# EAGLE design modularduino_uber (EAGLE 5.04)
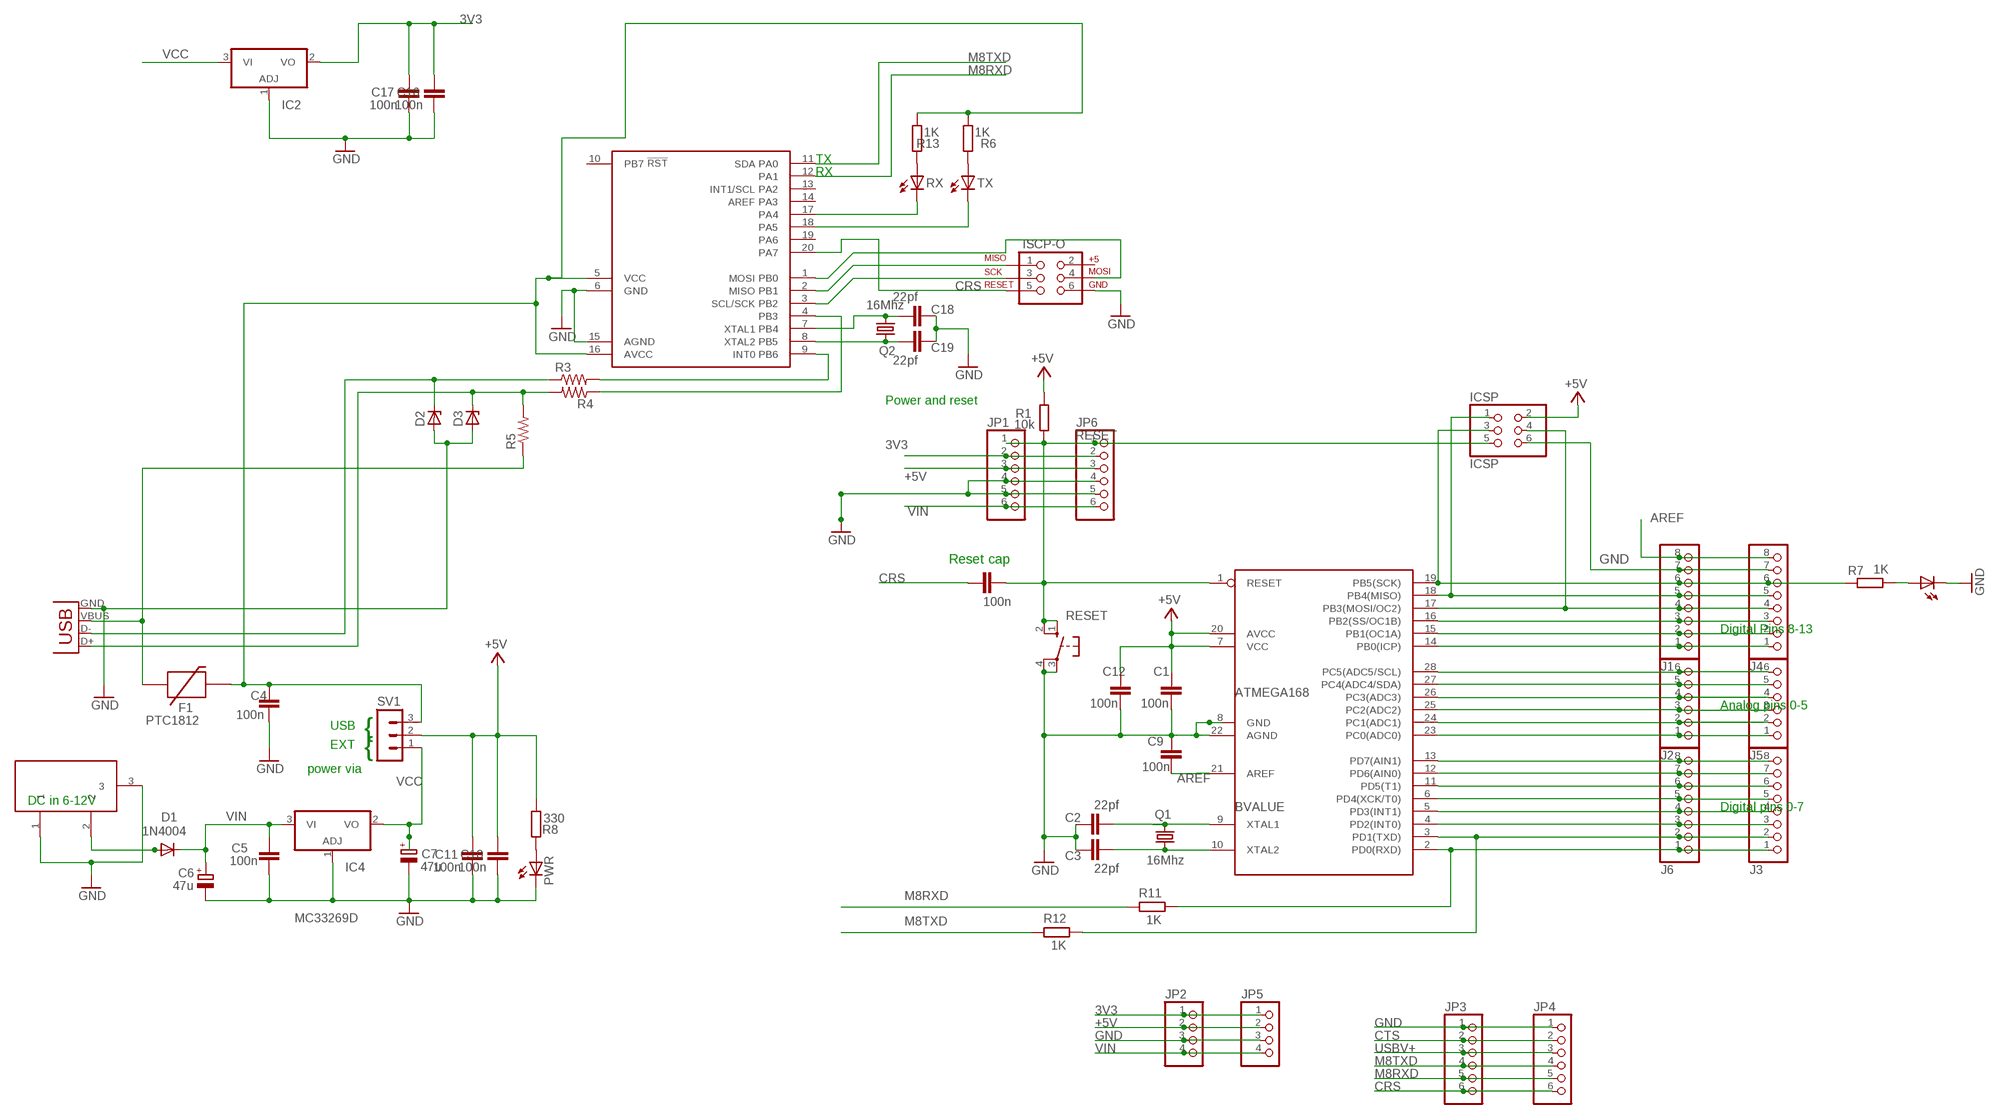
[diagram p0: schematic, sheet 1]

## Parts
BVALUE  ATMEGA168  MEGA8-P  [DIL28-3]
C1  100n  C-EUC1206  [C1206]
C2  22pf  C-EUC1206  [C1206]
C3  22pf  C-EUC1206  [C1206]
C4  100n  C-EUC1206  [C1206]
C5  100n  C-EUC1206  [C1206]
C6  47u  CPOL-EUD  [PANASONIC_D]
C7  47u  CPOL-EUD  [PANASONIC_D]
C9  100n  C-EUC1206  [C1206]
C10  100n  C-EUC1206  [C1206]
C11  100n  C-EUC1206  [C1206]
C12  100n  C-EUC1206  [C1206]
C16  100n  C-EUC1206  [C1206]
C17  100n  C-EUC1206  [C1206]
C18  22pf  C-EUC1206  [C1206]
C19  22pf  C-EUC1206  [C1206]
C20  100n  C-EUC1206  [C1206]
D1  1N4004  DIODEPTH  [DIODE-1N4001]
D2  ZENER-DIODESOD80C  [SOD80C]
D3  ZENER-DIODESOD80C  [SOD80C]
DC1  9V in  DC21MMX  [DC-21MM]
F1  PTC1812  [C1812]
IC2  MC33269D  [DPACK]
IC4  MC33269D  [DPACK]
ICSP  ICSP  PINHD-2X3  [2X03]
ISCP-O  AVR_SPI_PRG_6PTH  [2X3]
J1  PINHD-1X8  [1X08]
J2  PINHD-1X6  [1X06]
J3  PINHD-1X8  [1X08]
J4  PINHD-1X8  [1X08]
J5  PINHD-1X6  [1X06]
J6  PINHD-1X8  [1X08]
JP1  PINHD-1X6  [1X06]
JP2  PINHD-1X4  [1X04]
JP3  PINHD-1X6  [1X06]
JP4  PINHD-1X6  [1X06]
JP5  PINHD-1X4  [1X04]
JP6  PINHD-1X6  [1X06]
P13  LED-LCC1206  [LCC1206]
PWR  LED-LCC1206  [LCC1206]
Q1  16Mhz  CRYSTALHC49U-V  [HC49U-V]
Q2  16Mhz  CRYSTALHC49U-V  [HC49U-V]
R1  10k  R-EU_R1206  [R1206]
R3  R-US_R1206  [R1206]
R4  R-US_R1206  [R1206]
R5  R-US_R1206  [R1206]
R6  1K  R-EU_R1206  [R1206]
R7  1K  R-EU_R1206  [R1206]
R8  330  R-EU_R1206  [R1206]
R11  1K  R-EU_R1206  [R1206]
R12  1K  R-EU_R1206  [R1206]
R13  1K  R-EU_R1206  [R1206]
RESET  10-XX  [B3F-10XX]
RX  LED-LCC1206  [LCC1206]
SV1  MA03-1  [MA03-1]
TX  LED-LCC1206  [LCC1206]
U$1  ATTINY61-PDIP  [DIL20]
X2  USBSMD  [USB-MINIB]

## Nets
3V3 [power]: C16.2 C17.2 IC2.2(VO) JP1.2 JP2.1 JP5.1 JP6.2
+5V [power]: BVALUE.7(VCC) BVALUE.20(AVCC) C1.1 C10.2 C11.2 C12.1 ICSP.2 JP1.3 JP2.2 JP5.2 JP6.3 R1.2 R8.1 SV1.2
AREF: BVALUE.21(AREF) C9.1 J1.8 J4.8
CRS [finepitch]: C20.1 ISCP-O.5 JP3.6 JP4.6 U$1.20(PA7)
CTS: JP3.2 JP4.2
GND [power]: BVALUE.8(GND) BVALUE.22(AGND) C1.2 C2.1 C3.1 C4.1 C5.1 C6.- C7.- C9.2 C10.1 C11.1 C12.2 C16.1 C17.1 C18.1 C19.1 D2.A D3.A DC1.1 DC1.3 IC2.1(ADJ) IC4.1(ADJ) ICSP.6 ISCP-O.6 J1.7 J4.7 JP1.4 JP1.5 JP2.3 JP3.1 JP4.1 JP5.3 JP6.4 JP6.5 P13.C PWR.C RESET.3(P) RESET.4(P1) U$1.6(GND) U$1.15(AGND) X2.GND
M8RXD [finepitch]: JP3.5 JP4.5 R11.1 U$1.12(PA1)
M8TXD [finepitch]: JP3.4 JP4.4 R12.1 U$1.11(PA0)
N$2: BVALUE.15(PB1(OC1A)) J1.2 J4.2
N$3: PWR.A R8.2
N$6: BVALUE.9(XTAL1) C2.2 Q1.2
N$7 [power]: F1.1 R5.1 X2.VBUS
N$9: D2.C R3.1 X2.D-
N$10: BVALUE.4(PD2(INT0)) J3.3 J6.3
N$11: BVALUE.5(PD3(INT1)) J3.4 J6.4
N$12: BVALUE.6(PD4(XCK/T0)) J3.5 J6.5
N$13: BVALUE.11(PD5(T1)) J3.6 J6.6
N$14: BVALUE.12(PD6(AIN0)) J3.7 J6.7
N$15: BVALUE.13(PD7(AIN1)) J3.8 J6.8
N$16: BVALUE.23(PC0(ADC0)) J2.1 J5.1
N$17: BVALUE.24(PC1(ADC1)) J2.2 J5.2
N$18: BVALUE.25(PC2(ADC2)) J2.3 J5.3
N$19: BVALUE.26(PC3(ADC3)) J2.4 J5.4
N$20: BVALUE.27(PC4(ADC4/SDA)) J2.5 J5.5
N$21: BVALUE.28(PC5(ADC5/SCL)) J2.6 J5.6
N$22: BVALUE.3(PD1(TXD)) J3.2 J6.2 R12.2
N$23: BVALUE.16(PB2(SS/OC1B)) J1.3 J4.3
N$26: BVALUE.18(PB4(MISO)) ICSP.1 J1.5 J4.5
N$28: BVALUE.14(PB0(ICP)) J1.1 J4.1
N$31: BVALUE.10(XTAL2) C3.2 Q1.1
N$32: P13.A R7.1
N$35 [finepitch]: D3.C R4.2 R5.2 X2.D+
N$37: C18.2 Q2.1 U$1.7(PB4)
N$38: C19.2 Q2.2 U$1.8(PB5)
N$39: R3.2 U$1.9(PB6)
N$40: ISCP-O.4 U$1.1(PB0)
N$41: ISCP-O.1 U$1.2(PB1)
N$42: ISCP-O.3 U$1.3(PB2)
N$44: BVALUE.2(PD0(RXD)) J3.1 J6.1 R11.2
N$45: D1.A DC1.2
N$49: R4.1 U$1.4(PB3)
N$52: R13.2 RX.A
N$53 [finepitch]: RX.C U$1.17(PA4)
N$54 [finepitch]: TX.C U$1.18(PA5)
N$55: R6.2 TX.A
N$92: BVALUE.17(PB3(MOSI/OC2)) ICSP.4 J1.4 J4.4
RESET: BVALUE.1(RESET) C20.2 ICSP.5 JP1.1 JP6.1 R1.1 RESET.1(S) RESET.2(S1)
SCK: BVALUE.19(PB5(SCK)) ICSP.3 J1.6 J4.6 R7.2
USBV+ [power]: C4.2 F1.2 JP3.3 JP4.3 R6.1 R13.1 SV1.3 U$1.5(VCC) U$1.16(AVCC)
VCC [power]: C7.+ IC2.3(VI) IC4.2(VO) SV1.1
VIN [power]: C5.2 C6.+ D1.C IC4.3(VI) JP1.6 JP2.4 JP5.4 JP6.6
Unconnected: ISCP-O.2 U$1.10(PB7) U$1.13(PA2) U$1.14(PA3) U$1.19(PA6)

## Notes on the sheet
- TX
- RX
- Power and reset
- Reset cap
- Digital Pins 8-13
- Analog pins 0-5
- USB
- {
- EXT
- {
- power via
- DC in 6-12V
- Digital pins 0-7

## Library data of the parts
BVALUE = my-library:MEGA8-P: MICROCONTROLLER 8 Kbytes FLASH 1 kbytes SRAM 512 bytes EEPROM USART 4-channel 10 bit ADC 2-channel 8 bit ADC Source: avr.lbr
C1-C5 C9-C12 C16-C20 = rcl:C-EU: CAPACITOR, European symbol
C6 C7 = rcl:CPOL-EU: POLARIZED CAPACITOR, European symbol
D1 = SparkFun:DIODE: Diode These are standard reverse protection diodes and small signal diodes. SMA package can handle up to about 1A. SOD-323 can handle about 200mA. What the SOD-323 package when ordering, there are some mfgs out there that are 5-pin packages.
D2 D3 = diode:ZENER-DIODE: Z-Diode
DC1 = powersupply:DC21MM
F1 = SparkFunEagle-6-6-07:PTC: Resettable Fuse PTC Resettable Fuse. Spark Fun Electronics SKU : COM-08357
IC2 IC4 = linear:MC33269?*: Adjustable Output Low Dropout Voltage Regulator 800 mA Source: http://www.onsemi.com/pub/Collateral/MC33269-D.PDF
ICSP = pinhead:PINHD-2X3: PIN HEADER
ISCP-O = SparkFun:AVR_SPI_PRG_6: AVR ISP 6 Pin This is the reduced ISP connector for AVR programming. Common on Arduino. This footprint will take up less PCB space and can be used with a 10-pin to 6-pin adapter such as SKU: BOB-08508
J1 J3 J4 J6 = pinhead:PINHD-1X8: PIN HEADER
J2 J5 JP1 JP3 JP4 JP6 = pinhead:PINHD-1X6: PIN HEADER
JP2 JP5 = pinhead:PINHD-1X4: PIN HEADER
P13 PWR RX TX = my-led:LED: LED OSRAM: - CHIPLED LG R971, LG N971, LY N971, LG Q971, LY Q971, LO R971, LY R971 LH N974, LH R974 LS Q976, LO Q976, LY Q976 LO Q996 - Hyper CHIPLED LW Q18S LB Q993, LB Q99A, LB R99A - SideLED LS A670, LO A670, LY A670, LG A670, LP A670 LB A673, LV A673, LT A673, LW A673 LH A674 LY A675 LS A676, LA A676, LO A676, LY A676, LW A676 LS A679, LY A679, LG A679 - Hyper Micro SIDELED® LS Y876, LA Y876, LO Y876, LY Y876 LT Y87S - SmartLED LW L88C, LW L88S LB L89C, LB L89S, LG L890 LS L89K, LO L89K, LY L89K LS L896, LA L896, LO L896, LY L896 - TOPLED LS T670, LO T670, LY T670, LG T670, LP T670 LSG T670, LSP T670, LSY T670, LOP T670, LYG T670 LG T671, LOG T671, LSG T671 LB T673, LV T673, LT T673, LW T673 LH T674 LS T676, LA T676, LO T676, LY T676, LB T676, LH T676, LSB T676, LW T676 LB T67C, LV T67C, LT T67C, LS T67K, LO T67K, LY T67K, LW E67C LS E67B, LA E67B, LO E67B, LY E67B, LB E67C, LV E67C, LT E67C LW T67C LS T679, LY T679, LG T679 LS T770, LO T770, LY T770, LG T770, LP T770 LB T773, LV T773, LT T773, LW T773 LH T774 LS E675, LA E675, LY E675, LS T675 LS T776, LA T776, LO T776, LY T776, LB T776 LHGB T686 LT T68C, LB T68C - Hyper Mini TOPLED® LB M676 - Mini TOPLED Santana® LG M470 LS M47K, LO M47K, LY M47K Source: http://www.osram.convergy.de/
Q1 Q2 = crystal:CRYSTAL: CRYSTAL
R1 R6-R8 R11-R13 = rcl:R-EU_: RESISTOR, European symbol
R3-R5 = resistor:R-US_: RESISTOR, American symbol
RESET = switch-omron:10-XX: OMRON SWITCH
SV1 = con-lstb:MA03-1: PIN HEADER
U$1 = SparkFun:ATTINY*61-PDIP
X2 = SparkFun:USB: USB Connectors USB-B-PTH is fully proven SKU : PRT-00139 USB-miniB is fully proven SKU : PRT-00587 USB-A-PCB is untested. USB-A-H is throughly reviewed, but untested. Spark Fun Electronics SKU : PRT-00437 USB-B-SMT is throughly reviewed, but untested. Needs silkscreen touching up. USB-A-S has not been used/tested USB-MB-H has not been used/tested

## Net classes
0 default: width 0.254 mm, clearance 0.203 mm
1 power: width 0.508 mm, clearance 0.305 mm
2 finepitch: width 0.203 mm, clearance 0.203 mm

## Board
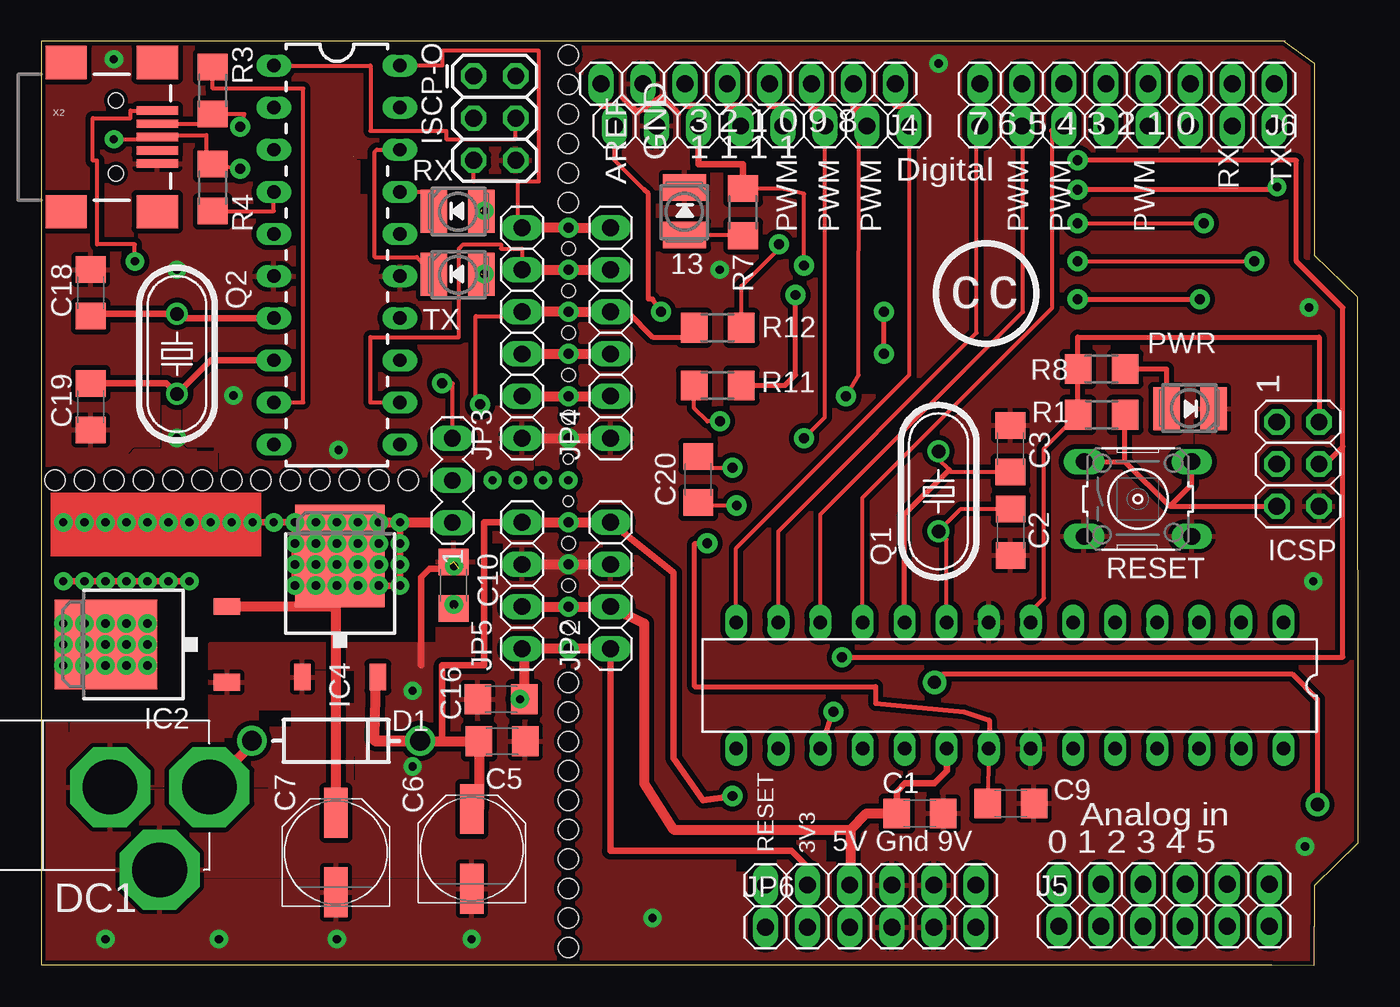
[diagram p1: board, top side]
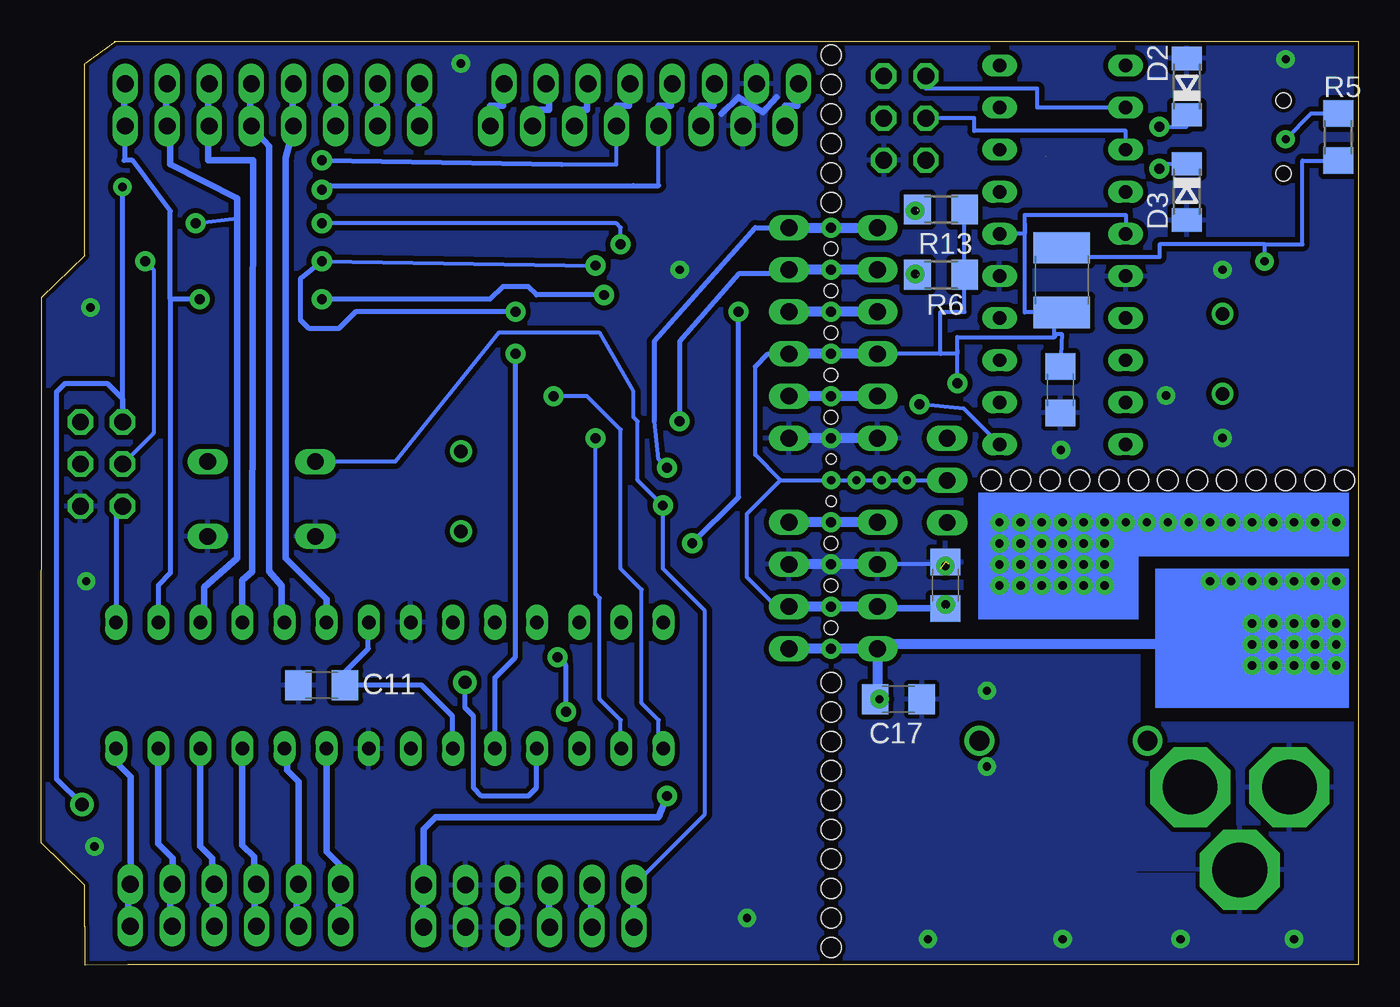
[diagram p2: board, bottom side, seen from below]

Size 79.46 x 55.73 mm. Coordinates in mm from the lower left corner, seen from the top.
Outline: 76.84,2.32 76.85,2.35 76.85,4.83 79.46,7.39
Outline: 76.85,42.82 76.85,54.38 75.02,55.72
Outline: 76.82,2.34 76.83,0 74.26,0.01 0,0.01 0,55.73 75.08,55.73
Outline: 79.46,7.39 79.45,40.28 76.8,42.82
Copper layers (1*16): Top 0.035mm / dielectric 1.5mm / Bottom 0.035mm
Design rules "default *": minimum track width 10mil, minimum drill 0.6mm, track to track 8mil, track to pad 8mil, pad to pad 8mil, via to via 12mil, smd to smd 8mil, copper to edge 10mil, drill to drill 15mil, minimum pad ring 10mil, minimum via ring 12mil, stop-mask expansion 4mil, vias tented up to drill 30mil, thermal gap 10mil
Holes 1.2 mm at 0.81,29.26 2.59,29.26 4.37,29.26 6.15,29.26 7.92,29.26 9.7,29.26 11.48,29.26 13.26,29.26 15.04,29.26 16.81,29.26 18.59,29.26 20.37,29.26 22.15,29.26 31.8,2.84 31.8,4.62 31.8,6.4 31.8,8.17 31.8,9.95 31.8,11.73 31.8,13.51 31.8,15.29 31.8,17.06 31.8,46.02 31.8,47.8 31.8,49.58 31.8,51.35 31.8,53.13 31.8,54.91 31.8,1.06
Holes 0.8 mm at 31.8,22.91 31.8,25.45 31.8,43.23 31.8,40.69 31.8,38.15 31.8,35.61 31.8,33.07 31.8,20.37
Holes 0.6 mm at 31.8,27.99 31.8,30.53
tRestrict: area 26.8,40.9 to 27.8,42.8; area 26.9,23.5 to 27.8,25.4; area 33.9,23.4 to 34.8,25.4; area 19.3,46.5 to 20.2,48.4; area 9.4,47.5 to 10.3,49.4; area 58.2,28.9 to 59.2,30.8; area 13.1,14.4 to 15,15.4; area 14.2,27.6 to 16.1,28.6; area 17.9,15.8 to 18.8,17.7; area 46.9,28.1 to 48.8,29.1; area 46.9,23.1 to 48.8,24; area 47.4,6.3 to 48.3,8.2; 2 more areas; 32 lines
bRestrict: 3 lines

### Footprints (pad centres in the part's own frame; a part is rotated, then mirrored left to right if it is on the bottom)
DIL28-3 = drill 0.813 long: 1 -16.51,-3.81; 2 -13.97,-3.81; 3 -11.43,-3.81; 4 -8.89,-3.81; 5 -6.35,-3.81; 6 -3.81,-3.81; 7 -1.27,-3.81; 8 1.27,-3.81; 9 3.81,-3.81; 10 6.35,-3.81; 11 8.89,-3.81; 12 11.43,-3.81; 13 13.97,-3.81; 14 16.51,-3.81; 15 16.51,3.81; 16 13.97,3.81; 17 11.43,3.81; 18 8.89,3.81; 19 6.35,3.81; 20 3.81,3.81; 21 1.27,3.81; 22 -1.27,3.81; 23 -3.81,3.81; 24 -6.35,3.81; 25 -8.89,3.81; 26 -11.43,3.81; 27 -13.97,3.81; 28 -16.51,3.81
C1206 = smd 1.6 x 1.8: 1 -1.4,0; 2 1.4,0
PANASONIC_D = smd 3 x 1.4: + 2.4,0; - -2.4,0
DIODE-1N4001 = drill 1.2 round: A -5.08,0; C 5.08,0
SOD80C = smd 1.4 x 1.8: A 1.7,0; C -1.7,0
DC-21MM = drill 3.302 pad 4.826 octagon: 1 -5.08,-3.353; 2 -0.076,-6.35; 3 -0.076,-0.356
C1812 = smd 1.9 x 3.4: 1 -1.95,0; 2 1.95,0
DPACK = smd 1 x 1.6: 1 -2.28,-4.8; 3 2.28,-4.8 | smd 5.4 x 6.2: 2 0,2.5
2X03 = drill 1.016 octagon: 1 -2.54,-1.27; 2 -2.54,1.27; 3 0,-1.27; 4 0,1.27; 5 2.54,-1.27; 6 2.54,1.27
2X3 = drill 1.016 octagon: 1 0,0; 2 0,2.54; 3 2.54,0; 4 2.54,2.54; 5 5.08,0; 6 5.08,2.54
1X08 = drill 1.016 long: 1 -8.89,0; 2 -6.35,0; 3 -3.81,0; 4 -1.27,0; 5 1.27,0; 6 3.81,0; 7 6.35,0; 8 8.89,0
1X06 = drill 1.016 long: 1 -6.35,0; 2 -3.81,0; 3 -1.27,0; 4 1.27,0; 5 3.81,0; 6 6.35,0
1X04 = drill 1.016 long: 1 -3.81,0; 2 -1.27,0; 3 1.27,0; 4 3.81,0
LCC1206 = smd 2.6 x 1.6: A -0.025,1.375; C -0.025,-1.475
HC49U-V = drill 0.813 round: 1 -2.413,0; 2 2.413,0
R1206 = smd 1.6 x 1.803: 1 -1.422,0; 2 1.422,0
B3F-10XX = drill 1.016 long: 1 -3.251,2.261; 2 3.251,2.261; 3 -3.251,-2.261; 4 3.251,-2.261
MA03-1 = drill 1.016 long: 1 -2.54,0; 2 0,0; 3 2.54,0
DIL20 = drill 0.813 long: 1 1.27,-7.62; 2 3.81,-7.62; 3 6.35,-7.62; 4 8.89,-7.62; 5 11.43,-7.62; 6 13.97,-7.62; 7 16.51,-7.62; 8 19.05,-7.62; 9 21.59,-7.62; 10 24.13,-7.62; 11 24.13,0; 12 21.59,0; 13 19.05,0; 14 16.51,0; 15 13.97,0; 16 11.43,0; 17 8.89,0; 18 6.35,0; 19 3.81,0; 20 1.27,0
USB-MINIB = smd 2.5 x 0.5: D+ 2.5,0; D- 2.5,0.8; GND 2.5,-1.6; ID 2.5,-0.8; VBUS 2.5,1.6 | smd 2.5 x 2: GND@1 -3,-4.5; GND@2 -3,4.5; GND@3 2.5,4.5; GND@4 2.5,-4.5 | hole 0.9: 0,2.2; 0,-2.2

### Placement (x,y rotation side)
BVALUE  58.44,16.88 180 top
C1  53.02,9.15 0 top
C2  58.49,26.13 90 top
C3  58.48,31.16 270 top
C4  17.96,34.73 90 bottom
C5  27.8,13.5 180 top
C6  25.97,7.02 90 top
C7  17.77,6.8 90 top
C9  58.5,9.75 0 top
C10  24.88,22.93 270 top
C11  62.54,16.89 0 bottom
C12  24.91,22.92 90 bottom
C16  27.74,16.05 0 top
C17  27.74,16.05 180 bottom
C18  2.97,40.56 270 top
C19  2.97,33.7 90 top
C20  39.64,29.3 270 top
D1  17.78,13.53 0 top
D2  10.34,53 90 bottom
D3  10.34,46.65 270 bottom
DC1  3.78,10.82 90 top
F1  17.88,41.33 270 bottom
IC2  6.4,19.35 90 top
IC4  18.03,22.18 0 top
ICSP  75.83,30.23 270 top
ISCP-O  26.09,53.64 270 top
J1  43.47,50.63 180 top
J2  67.76,4.88 0 top
J3  65.52,50.63 180 top
J4  42.66,53.17 180 top
J5  67.75,2.34 0 top
J6  65.52,53.17 180 top
JP1  50.05,4.83 0 top
JP2  34.34,22.91 90 top
JP3  29.01,38.15 90 top
JP4  34.34,38.15 90 top
JP5  29.01,22.91 90 top
JP6  50.05,2.29 0 top
P13  38.8,45.43 180 top
PWR  69.27,33.6 90 top
Q1  54.14,28.59 270 top
Q2  8.18,36.88 270 top
R1  63.98,33.2 180 top
R3  10.34,52.78 90 top
R4  10.34,46.91 90 top
R5  1.19,49.96 90 bottom
R6  25.17,41.65 180 bottom
R7  42.34,45.43 90 top
R8  63.98,35.97 0 top
R11  40.81,34.97 0 top
R12  40.81,38.46 0 top
R13  25.17,45.59 180 bottom
RESET  66.17,28.12 0 top
RX  25.17,45.46 270 top
SV1  24.8,29.24 90 top
TX  25.17,41.65 270 top
U$1  21.64,55.54 270 top
U$3  [CC-LOGO]  57.91,41.13 0 top
X2  4.5,49.96 0 top

### Tracks (layer width: path | path; a pad name or v marks a point on that pad's centre or on a via)
3V3  (via drill 0.6)  (1 unrouted)
  Top 0.406: JP2.1 34.34,6.9 45.26,6.9 46.24,5.93 JP1.2 JP6.2
  Top 0.61: v31.8,19.1 29.51,19.1 | JP5.1 29.51,19.1 | JP2.1 32.05,19.1 | C17.2 29.14,19.1 29.51,19.1
  Bottom 0.61: JP5.1 v31.8,19.1 JP2.1 | JP5.1 29.01,16.05 C17.2 | JP5.1 29.01,19.35 IC2.2
+5V  (via drill 0.5, 0.6)  (1 unrouted)
  Top 0.254: R1.2 60.5,31.15 60.5,22.14 59.71,21.35 BVALUE.7
  Top 0.305: R1.2 R8.1 62.53,35.97 62.53,37.89 77.1,37.89 ICSP.2
  Top 0.406: C1.1 51.62,10.47 52.12,10.97 53.9,10.97 54.66,11.73 54.66,13.04 BVALUE.20 | JP1.3 JP6.3
  Top 0.61: JP5.2 v31.8,21.64 JP2.2 36.37,20.62 36.37,10.97 38.15,8.17 48.82,8.17 | C1.1 49.8,9.15 48.82,8.17 | 48.82,8.17 48.82,4.87 JP1.3
  Bottom 0.254: 36.37,36.11 36.37,30.78 34.85,29.26 | 34.85,29.26 v31.8,29.26 v30.28,29.26 29.26,29.26 | 29.26,29.26 v28.75,29.26 | 35.1,21.64 36.88,23.41 36.88,27.22 34.85,29.26 | SV1.2 29.26,29.24 29.26,29.26
  Bottom 0.305: 36.37,36.11 35.61,36.88 | BVALUE.7 59.74,20.66 59.74,19.1 61.14,17.7 C11.2 56.52,16.89 54.66,15.03 54.66,13.1 BVALUE.20
  Bottom 0.406: JP5.2 29.01,21.52 C12.1
  Bottom 0.61: JP5.2 v31.8,21.64 JP2.2 35.1,21.64
AREF  (via drill 0.6)
  Top 0.254: BVALUE.21 C9.1 | J1.8 34.58,48.57 36.37,46.78
  Top 0.305: 36.37,46.78 36.63,46.53 36.63,40.18 36.88,40.18 v37.39,39.42 | v40.18,25.45 39.42,25.45 39.42,16.81 50.34,16.81 50.34,15.79 55.68,15.29 57.2,14.78 57.2,13.1 BVALUE.21
  Top 0.406: J1.8 34.58,51.86 33.83,51.86 33.83,53.17 J4.8
  Bottom 0.305: v37.39,39.42 37.39,28.24 v40.18,25.45 | BVALUE.21 56.95,13.29
CRS  (via drill 0.6)
  Top 0.254: v41.71,30.02 40.32,30.02 C20.1 | U$1.20 24.18,54.27 24.18,55.16 30.02,55.16 30.02,47.29 28.75,47.29 | 28.75,47.29 26.09,47.29 ISCP-O.5 | JP3.6 28.75,44.5 28.75,47.29
  Top 0.61: JP3.6 v31.8,44.5 34.59,44.5
  Bottom 0.254: 42.47,32.81 42.21,30.53 v41.71,30.02
  Bottom 0.305: JP4.6 36.37,44.5 42.47,37.64 42.47,32.81
  Bottom 0.61: JP3.6 v31.8,44.5 JP4.6
CTS  (via drill 0.6)
  Top 0.61: JP3.2 v31.8,34.34 JP4.2
  Bottom 0.61: JP3.2 v31.8,34.34 JP4.2
GND  (via drill 0.5, 0.6)  (4 unrouted)
  Top 0.406: 24.69,24.18 24.43,23.92 23.42,23.92 22.91,23.41 22.91,18.08 | 38.4,51.35 37.39,52.37 35.94,51.47 35.1,52.37
  Top 0.61: JP3.1 v31.8,31.8 JP4.1 | JP5.3 v31.8,24.18 JP2.3
  Bottom 0.254: 25.2,23.92 25.45,24.18 JP5.3
  Bottom 0.406: 35.1,52.37 35.9,51.44 37.39,52.37 38.4,51.35
  Bottom 0.61: JP3.1 v31.8,31.8 JP4.1 | JP5.3 v31.8,24.18 JP2.3
  other vias: 3.86,1.57 10.72,1.57 17.83,1.57 25.96,1.57 8.18,31.8 8.18,41.96 17.93,31.07 4.37,54.66 40.94,41.96 76.76,23.16 76.5,39.67 76.25,7.16 36.88,2.84 54.15,54.4 22.4,16.56 22.4,11.98 11.58,34.37
  pour Top: -0.46,57.96 81.08,57.2 80.57,-0.72 0.05,-0.72 -0.2,14.52 10.21,14.52 10.21,19.35 23.93,19.35 23.93,29.26 -0.71,29.26
  pour Bottom: -0.46,57.96 81.08,57.2 80.31,-0.72 -0.2,-0.72 -0.2,14.52 13.26,14.52 13.26,19.35 23.93,19.35 23.93,29.26 -0.71,29
M8RXD  (via drill 0.6)
  Top 0.254: R11.1 39.39,33.6 40.18,32.81 v40.94,32.81 41.2,32.81 | U$1.12 19.86,33.95 19.86,37.89 25.2,37.89 25.2,43.23 25.45,43.48 27.74,43.48 27.74,43.23 29.01,43.23 JP3.5
  Top 0.61: JP3.5 v31.8,41.96 34.59,41.96
  Bottom 0.305: 34.59,41.7 37.39,41.7 40.94,37.64 v40.94,32.81
  Bottom 0.61: JP3.5 v31.8,41.96 JP4.5 34.59,41.7
M8TXD  (via drill 0.6)
  Top 0.254: v26.47,33.83 26.21,33.83 26.21,39.16 29.01,39.16 JP3.4
  Top 0.305: R12.1 38.83,37.89 36.88,37.89 35.36,39.42 JP4.4
  Top 0.61: JP3.4 29.51,39.42 | 29.51,39.42 v31.8,39.42 JP4.4 | 29.51,39.42 29.26,39.16
  Bottom 0.254: U$1.11 23.8,33.57 v26.47,33.83
  Bottom 0.61: JP3.4 v31.8,39.42 JP4.4
N$2  (via drill 0.6)
  Top 0.254: J1.2 49.82,51.09 49.33,50.59 49.32,35.6 v48.56,34.34
  Top 0.406: J4.2 49.01,51.61 49.83,51.61 49.83,50.63 J1.2
  Bottom 0.254: v48.56,34.34 46.53,34.34 44.5,32.3 44.5,23.92 43.23,22.65 43.23,15.79 42.21,14.78 42.21,13.35 BVALUE.15
N$3
  Top 0.305: R8.2 67.89,35.97 PWR.A
N$5  (via drill 0.5)
  other vias: 26.72,41.7
N$6
  Top 0.254: BVALUE.9 54.63,25.69 Q1.2 55.49,27.53 C2.2
N$7  (via drill 0.5)
  Top 0.254: X2.VBUS 5.38,51.56 5.38,51.1 3.1,51.1 3.1,48.53 3.35,48.53 3.35,43.48 5.64,43.48 v5.64,42.46
  Bottom 0.254: R5.1 3.35,48.53 3.35,43.48 5.64,43.48 | 5.64,43.48 11.99,43.48 11.99,42.72 17.88,42.72 F1.1 | v5.64,42.46 5.64,43.48
N$8  (via drill 0.5)
  other vias: 26.72,45.51
N$9  (via drill 0.6)
  Top 0.254: X2.D- 10.34,50.76 R3.1 12.24,51.35 v11.99,50.59
  Bottom 0.254: D2.C 10.34,50.59 v11.99,50.59
N$10
  Top 0.406: J6.3 J3.3
  Bottom 0.406: BVALUE.4 67.33,23.21 66.74,23.74 66.67,48.28 66.67,48.56 69.39,48.56 69.39,50.59 | 69.39,50.59 69.39,50.63 J3.3 | 69.39,50.59 69.39,53.39
N$11
  Top 0.406: J3.4 J6.4
  Bottom 0.406: BVALUE.5 64.96,20.85 64.96,22.88 65.7,23.76 65.7,49.4 66.79,50.62 J3.4
N$12
  Top 0.406: J3.5 J6.5
  Bottom 0.406: BVALUE.6 62.25,22.08 64.72,24.55 64.72,48.72 64.23,50.48 64.23,50.63 J3.5
N$13
  Top 0.254: BVALUE.11 49.55,28.21 61.01,39.67 61.01,50.34
  Top 0.406: J6.6 J3.6 61.71,50.34 61.01,50.34
N$14
  Top 0.254: BVALUE.12 47.01,27.19 59.23,39.42 59.23,50.32 J3.7
  Top 0.406: J6.7 J3.7
N$15
  Top 0.254: BVALUE.13 44.47,26.18 56.44,38.15 56.44,50.44
  Top 0.406: J6.8 J3.8 56.63,50.44 56.44,50.44
N$16
  Top 0.406: J2.1 J5.1
  Bottom 0.406: BVALUE.23 62.25,6.84 61.47,6.06 61.47,4.94 J2.1
N$17
  Top 0.406: J2.2 J5.2
  Bottom 0.406: J2.2 63.95,11.08 64.64,11.77 64.64,12.92 BVALUE.24
N$18
  Top 0.406: J2.3 J5.3
  Bottom 0.406: BVALUE.25 67.33,7.24 66.63,6.54 66.63,5.02 J2.3
N$19
  Top 0.406: J2.4 J5.4
  Bottom 0.406: BVALUE.26 69.87,7.16 69.16,6.46 69.16,5.02 J2.4
N$20
  Top 0.406: J2.5 J5.5
  Bottom 0.406: BVALUE.27 72.41,7.32 71.54,6.46 71.54,4.91 J2.5
N$21
  Top 0.406: J2.6 J5.6
  Bottom 0.406: BVALUE.28 74.95,12.24 74.08,11.38 74.08,4.91 J2.6
N$22  (via drill 0.6)
  Top 0.254: R12.2 42.24,40.96 44.5,43.23 v44.5,43.48 | v62.53,44.75 v70.15,44.75
  Top 0.406: J6.2 J3.2
  Bottom 0.254: v44.5,43.48 44.5,44.5 44.75,44.75 v62.53,44.75 | v70.15,44.75 67.64,45.07
  Bottom 0.406: BVALUE.3 69.64,20.92 69.64,22.8 67.64,24.55 67.64,45.07 67.64,46.27 71.68,48.31 71.68,50.63 J3.2
N$23  (via drill 0.6)
  Top 0.254: J1.3 47.28,33.06 v46.02,31.8
  Top 0.406: J4.3 46.47,51.61 47.29,51.61 47.29,50.63 J1.3
  Bottom 0.254: v46.02,31.8 46.02,22.4 45.77,22.14 45.77,16.05 44.5,14.78 44.5,13.1 BVALUE.16
N$24  (via drill 0.5)
  other vias: 27.23,29.26
N$26  (via drill 0.5, 0.6, 0.8)
  Top 0.305: 74.22,46.78 v74.56,46.94 74.56,47.04 74.22,46.78 | 74.22,46.78 v62.53,46.78 | v77.01,9.7 77.01,16.05 75.49,17.57 54.41,17.57 v53.9,17.06
  Top 0.406: J4.5 41.39,51.86 42.21,51.86 42.21,50.63 J1.5
  Bottom 0.254: J1.5 42.2,47.04 43.74,47.04
  Bottom 0.305: v62.53,46.78 62.03,47.04 43.74,47.04 42.21,47.04 | v77.01,9.7 78.54,11.22 78.54,34.59 78.03,35.1 75.49,35.1 74.56,34.17 ICSP.1 v74.56,46.94 | v53.9,17.06 53.9,15.54 53.39,15.03 53.39,10.71 52.88,10.21 50.09,10.21 49.58,10.71 49.58,13.07 BVALUE.18
N$27  (via drill 0.5)
  other vias: 24.89,21.76
N$28
  Top 0.254: BVALUE.14 41.93,25.16 52.37,35.61 52.37,51.86
  Top 0.406: J4.1 51.55,51.86 52.37,51.86 52.37,50.63 J1.1
N$29  (via drill 0.5)
  other vias: 28.88,16.05
N$31
  Top 0.254: Q1.1 54.14,30.54 54.79,29.89 54.91,29.76 C3.2
  Top 0.305: BVALUE.10 52.09,27.19 54.79,29.89
N$32
  Top 0.254: P13.A 42.29,44.05 R7.1
N$34  (via drill 0.5)
  other vias: 3.86,19.35
N$35  (via drill 0.5, 0.6)
  Top 0.254: v11.99,48.05 10.34,48.31 R4.2 9.96,48.33 9.96,50.08 7,50.08 X2.D+ 7,49.83 v4.37,49.83
  Bottom 0.254: v11.99,48.05 12.24,48.35 D3.C | R5.2 2.84,51.38 v4.37,49.83
N$36  (via drill 0.5)
  other vias: 2.59,19.35
N$37
  Top 0.406: C18.2 3.1,39.29 Q2.1 8.43,39.03 U$1.7
N$38
  Top 0.406: U$1.8 10.21,36.49 Q2.2 7.54,35.1 C19.2
N$39
  Top 0.254: R3.2 10.34,52.88 15.8,52.88 15.8,33.95 U$1.9
N$40
  Top 0.254: U$1.1 19.86,54.27 19.86,50.34 24.43,50.34 24.43,49.83 28.63,49.83 ISCP-O.4
N$41
  Bottom 0.254: U$1.2 19.35,51.73 19.35,52.88 26.09,52.88 ISCP-O.1
N$42
  Bottom 0.254: ISCP-O.3 23.16,51.1 23.16,50.34 14.02,50.34 U$1.3
N$44  (via drill 0.6)
  Top 0.305: R11.2 44.88,34.97 45.52,35.61 v45.52,40.43 | v62.53,40.18 v69.9,40.18
  Top 0.406: J6.1 J3.1
  Bottom 0.305: BVALUE.2 72.41,22.94 71.68,23.67 71.68,40.18 | 71.68,40.18 71.68,45.51 73.96,48.56 74.47,48.56 74.41,48.62 J3.1 | v45.52,40.43 49.58,40.43 50.09,40.94 51.61,40.94 52.37,40.18 v62.53,40.18 | v69.9,40.18 71.68,40.18
N$45
  Top 0.61: DC1.2 12.96,13.58 D1.A
N$46  (via drill 0.5)
  other vias: 1.32,19.35
N$47  (via drill 0.5)
  other vias: 1.32,20.62
N$48  (via drill 0.5)
  other vias: 2.59,20.62
N$49
  Top 0.254: U$1.4 14.02,45.49 R4.1
N$50  (via drill 0.5)
  other vias: 3.86,20.62
N$51  (via drill 0.5)
  other vias: 7.67,23.16
N$52  (1 unrouted)
N$53
  Top 0.254: U$1.17 23.7,46.65 RX.C
N$54
  Top 0.254: TX.C 22.65,42.72 20.12,42.72 20.12,49.07 20.24,49.19 U$1.18
N$55  (1 unrouted)
N$56
  Bottom 0.406: 43.74,2.33 43.74,4.87
N$57  (via drill 0.5)
  Top 0.406: v1.32,23.16 v8.94,23.16
N$58  (via drill 0.5)
  other vias: 2.59,23.16
N$59
  Bottom 0.406: 46.28,2.33 46.28,4.87
N$60
  Bottom 0.406: 48.82,2.33 48.82,4.87
N$61  (via drill 0.5)
  other vias: 3.86,23.16
N$62  (via drill 0.5)
  other vias: 5.13,23.16
N$63
  Bottom 0.406: 56.44,2.33 56.44,4.87
N$64
  Bottom 0.406: 61.52,2.33 61.52,4.87
N$65  (via drill 0.5)
  other vias: 6.4,23.16
N$66  (via drill 0.5)
  other vias: 24.9,24.07
N$67
  Bottom 0.406: 64.06,2.33 64.06,4.87
N$68
  Bottom 0.406: 66.6,2.33 66.6,4.87
N$69  (via drill 0.5)
  other vias: 1.32,18.08
N$70  (via drill 0.5)
  other vias: 2.59,18.08
N$71
  Bottom 0.406: 69.14,2.33 69.14,4.87
N$72
  Bottom 0.406: 74.22,2.33 74.22,4.87
N$73  (via drill 0.5)
  other vias: 3.86,18.08
N$74  (via drill 0.5)
  other vias: 5.13,18.08
N$75
  Bottom 0.406: 71.68,2.33 71.68,4.87
N$76
  Bottom 0.406: 74.47,50.59 74.47,53.13
N$77  (via drill 0.5)
  other vias: 6.4,18.08
N$78
  Bottom 0.406: 71.93,50.59 71.93,53.39
N$79  (via drill 0.5)
  other vias: 6.4,19.35
N$80  (via drill 0.5)
  other vias: 5.13,19.35
N$81  (via drill 0.5)
  other vias: 5.13,20.62
N$82  (via drill 0.5)
  other vias: 6.4,20.62
N$83
  Bottom 0.406: 66.85,50.59 66.85,53.39
N$84
  Bottom 0.406: 64.06,53.39 64.31,53.13 64.31,50.59
N$85
  Bottom 0.406: 61.77,50.34 61.77,53.13
N$86
  Bottom 0.406: 59.23,50.59 59.23,53.13
N$87
  Bottom 0.406: 56.69,50.59 56.69,53.39
N$88
  Bottom 0.406: 51.61,53.13 51.61,51.86 52.37,51.86 52.37,50.59
N$89
  Bottom 0.406: 48.82,53.13 48.82,51.61 49.83,51.61 49.83,50.59
N$90  (via drill 0.5)
  other vias: 1.32,26.72
N$91
  Bottom 0.406: 46.53,53.13 46.53,51.61 47.29,51.61 47.29,50.34
N$92  (via drill 0.6)
  Top 0.305: ICSP.4 77.48,30.23 78.54,31.29 | 78.54,31.29 78.54,39.67 75.74,42.46 75.74,48.56 v62.53,48.56 | BVALUE.17 47.77,15.26 v47.8,15.29 | v48.31,18.59 78.54,18.59 78.54,31.29
  Top 0.406: J4.4 43.93,51.86 44.75,51.86 44.75,50.63 J1.4
  Bottom 0.254: 48.06,48.31 44.75,48.31 44.75,50.59 44.75,50.63 J1.4
  Bottom 0.305: v62.53,48.56 48.06,48.31 | v47.8,15.29 47.8,18.08 v48.31,18.59
  Bottom 0.406: 43.99,53.13 43.99,51.86 44.75,51.86 44.75,50.59
N$93  (via drill 0.5)
  other vias: 2.59,26.72
N$94
  Bottom 0.406: 41.45,53.13 41.45,51.86 42.21,51.86 42.21,50.59
N$95
  Bottom 0.406: 38.91,53.13 38.91,51.86 39.67,51.86 39.67,50.59
N$96  (via drill 0.5)
  other vias: 3.86,26.72
N$97
  Bottom 0.406: 33.83,53.13 33.83,51.86 34.59,51.86 34.59,50.59
N$99  (via drill 0.5)
  other vias: 5.13,26.72
N$102  (via drill 0.5)
  other vias: 6.4,26.72
N$105  (via drill 0.5)
  other vias: 7.67,26.72
N$108  (via drill 0.5)
  other vias: 8.94,26.72
N$111  (via drill 0.5)
  other vias: 10.21,26.72
N$114  (via drill 0.5)
  other vias: 11.48,26.72
N$120  (via drill 0.5)
  other vias: 14.02,26.72
N$122  (via drill 0.5)
  other vias: 15.29,25.45
N$126  (via drill 0.5)
  Top 0.406: v15.29,26.72 v15.29,22.91 v16.56,22.91 | v16.56,22.91 v16.56,26.72 | v16.56,22.91 v17.83,22.91 v17.83,26.72 | v12.75,26.72 v17.83,26.72 | 19.35,26.72 v20.37,26.72 | v20.37,26.72 v21.64,26.72 v21.64,22.91 v20.37,22.91 v20.37,26.72 | v17.83,26.72 19.35,26.72 | 19.35,26.72 19.35,22.91 v19.1,22.91
N$127  (via drill 0.5)
  other vias: 16.56,25.45
N$130  (via drill 0.5)
  other vias: 17.83,25.45
N$131  (via drill 0.5)
  other vias: 19.1,25.45
N$132  (via drill 0.5)
  other vias: 19.1,26.72
N$136  (via drill 0.5)
  other vias: 20.37,25.45
N$139  (via drill 0.5)
  other vias: 21.64,25.45
N$140  (via drill 0.5)
  other vias: 15.29,24.18
N$143  (via drill 0.5)
  other vias: 16.56,24.18
N$148  (via drill 0.5)
  other vias: 17.83,24.18
N$149  (via drill 0.5)
  other vias: 19.1,24.18
N$152  (via drill 0.5)
  other vias: 20.37,24.18
N$157  (via drill 0.5)
  other vias: 21.64,24.18
RESET  (via drill 0.6)
  Top 0.254: v41.96,27.73 39.81,27.73 C20.2
  Top 0.305: RESET.1 65.4,30.39 | 65.4,30.39 R1.1 | 68.09,27.69 ICSP.5 | 65.4,30.39 68.09,27.69 | RESET.2 69.43,29.03 68.09,27.69
  Top 0.406: JP1.1 JP6.1
  Bottom 0.254: RESET.1 58.1,30.39 51.87,38.15 45.77,38.15 43.74,34.59 43.74,33.07 43.48,32.81 43.48,29.26 v41.96,27.73 41.96,23.92 39.42,21.38 39.42,9.11 JP1.1
  Bottom 0.305: BVALUE.1 74.95,27.31 ICSP.5
SCK  (via drill 0.6)
  Top 0.254: 42.34,47.16 R7.2 44.69,46.85 46.02,46.53 v46.02,42.21 | v62.53,42.46 v73.2,42.46
  Top 0.305: v50.85,36.88 v50.85,39.42
  Top 0.406: 42.34,47.16 42.34,48.31 39.66,48.31 J1.6 39.66,51.86 38.91,51.86 38.91,53.17 J4.6
  Bottom 0.254: v62.53,42.46 v46.02,42.21 | v73.2,42.46 72.69,41.96 72.69,32.1 ICSP.3
  Bottom 0.305: BVALUE.19 52.09,17.35 50.85,18.59 v50.85,36.88 | v50.85,39.42 60.5,39.42 61.52,38.4 63.3,38.4 63.8,38.91 63.8,41.45 v62.53,42.46
USBV+  (via drill 0.6)
  Top 0.254: SV1.3 24.82,35.1 v24.18,35.1
  Top 0.61: JP3.3 v31.8,36.88 JP4.3
  Bottom 0.254: R13.1 R6.1 23.75,39.42 25.2,39.42 25.2,36.88 | 25.2,36.88 JP3.3 | 20.12,44.75 20.12,45.26 14.02,45.26 U$1.5 | 20.12,44.75 20.12,39.38 18.34,39.38 | C4.2 17.88,38.08 18.15,38.08 18.34,37.89 | 18.34,37.89 24.18,37.89 24.18,37.13 | v24.18,35.1 24.18,37.13 | 18.34,39.38 F1.2 | 18.34,37.89 18.34,38.91 18.34,39.38 | U$1.16 20.12,44.11 20.12,44.75 | 25.2,36.88 24.18,36.88 24.18,37.13
  Bottom 0.61: v31.8,36.88 JP3.3 v31.8,36.88 | v31.8,36.88 JP4.3 v31.8,36.88
VCC
  Top 0.61: SV1.1 24.8,26.72 17.83,26.72 17.83,24.68 IC4.2 17.77,24.68 17.77,21.64 | C7.+ 17.77,21.64 | IC2.3 17.77,21.64
VIN  (via drill 0.6)
  Top 0.406: v41.71,10.21 39.93,9.95 38.15,12.49 38.15,23.67 JP2.4 | C5.2 24.18,13.51 24.18,18.08 26.72,18.08 26.72,26.72 JP5.4 | JP6.6 JP1.6
  Top 0.61: JP2.4 v31.8,26.72 JP5.4 27.99,26.72 | IC4.3 20.19,17.38 20.12,13.76 20.12,13.53 D1.C 20.19,13.5 C5.2 26.4,9.42 C6.+
  Bottom 0.406: JP1.6 56.4,8.21 55.68,8.94 42.21,8.94 v41.71,10.21
  Bottom 0.61: JP5.4 v31.8,26.72 JP2.4
(copper drawn outside any net)
  shapes: Bottom area x3, Top area x1

### Text on the board
tNames: 3 2 1 0 9 8 | 7 6 5 4 3 2 1 0 | RX | TX | GND | 1 1 1 1 | Digital | AREF | PWM | PWM | PWM | PWM | PWM | PWM | 13 | 1 | Analog in | RESET | 3V3 | 5V Gnd 9V | 0 1 2 3 4 5
Edit History: 20070908 WestfW: Fix Analog-In silk. Keep traces away from holes. | 20070908 WestfW: Play with silkscreen. Add PWM labels, etc. | 20070908 WestfW: Update sch and filenames to 1.14. Clean up silkscreen | 20070907 WestfW: Reverse USB connector pinout. Add hole for resonator | 20070906 WestfW: Convert SMT parts to 0805 size | 20070906 WestfW: Additional copper for VR heatsink. | 20070906 WestfW: Add in Mounting holes. Additional bypass caps. | 20070904 WestfW: Rotate Crystal for GND Guard Ring, move some caps | 20070903 WestfW: Initial manual Route | 20070900 Daniel: Schematic and initial placement
SILKSCREEN_TBA: PCB by zbanks | olopede industries | olopede.com/uber